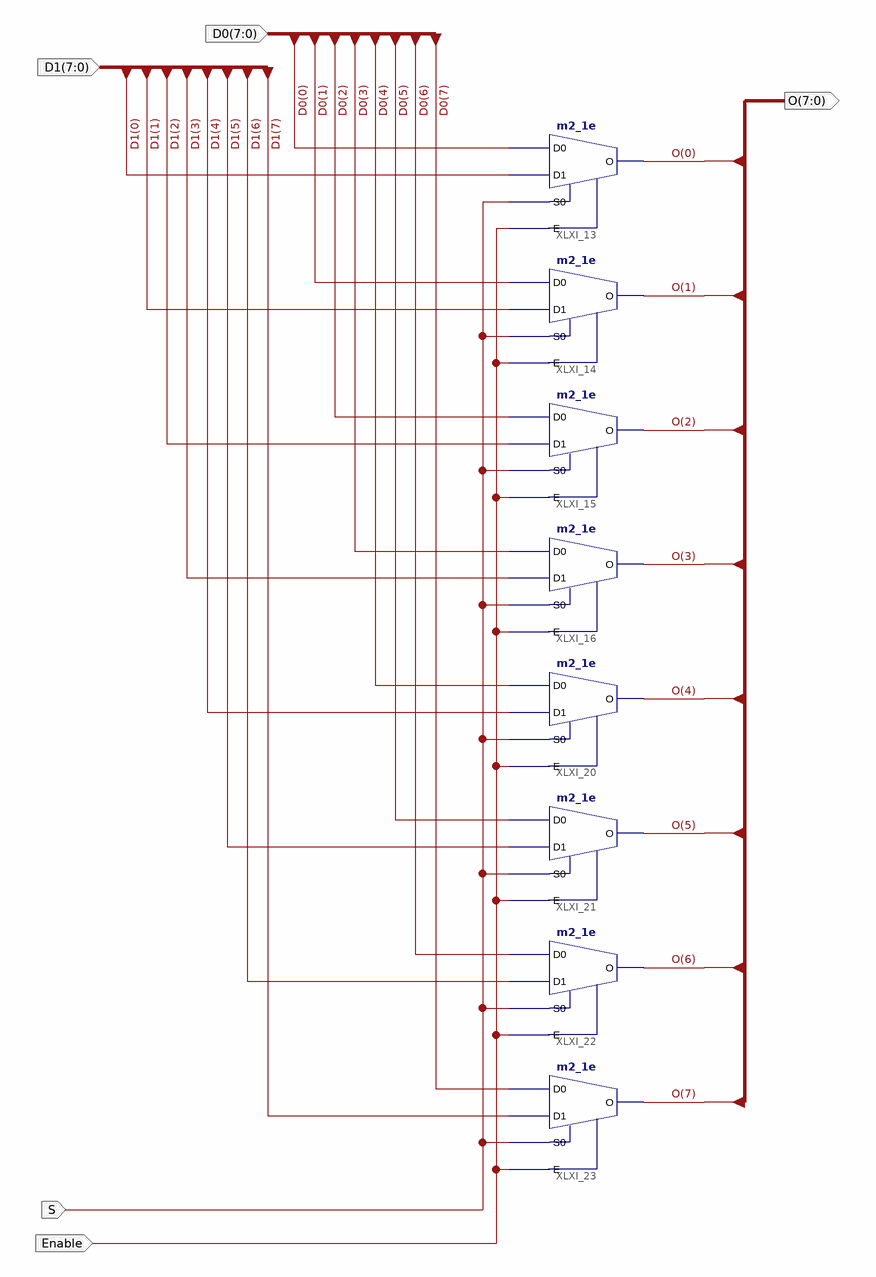
[diagram p0: schematic sheet 1]
// Xilinx ISE schematic mux2x1x8e.sch (spartan6) as structural Verilog: 8 symbols, 5 ports
module mux2x1x8e (
  input  [7:0] D1,
  input  [7:0] D0,
  input  Enable,
  input  S,
  output [7:0] O
);

  m2_1e XLXI_13 (.D0(D0[0]), .D1(D1[0]), .E(Enable), .S0(S), .O(O[0]));
  m2_1e XLXI_14 (.D0(D0[1]), .D1(D1[1]), .E(Enable), .S0(S), .O(O[1]));
  m2_1e XLXI_15 (.D0(D0[2]), .D1(D1[2]), .E(Enable), .S0(S), .O(O[2]));
  m2_1e XLXI_16 (.D0(D0[3]), .D1(D1[3]), .E(Enable), .S0(S), .O(O[3]));
  m2_1e XLXI_20 (.D0(D0[4]), .D1(D1[4]), .E(Enable), .S0(S), .O(O[4]));
  m2_1e XLXI_21 (.D0(D0[5]), .D1(D1[5]), .E(Enable), .S0(S), .O(O[5]));
  m2_1e XLXI_22 (.D0(D0[6]), .D1(D1[6]), .E(Enable), .S0(S), .O(O[6]));
  m2_1e XLXI_23 (.D0(D0[7]), .D1(D1[7]), .E(Enable), .S0(S), .O(O[7]));
endmodule
